# Altium schematic sheet teensyRecord.SchDoc
size Legal
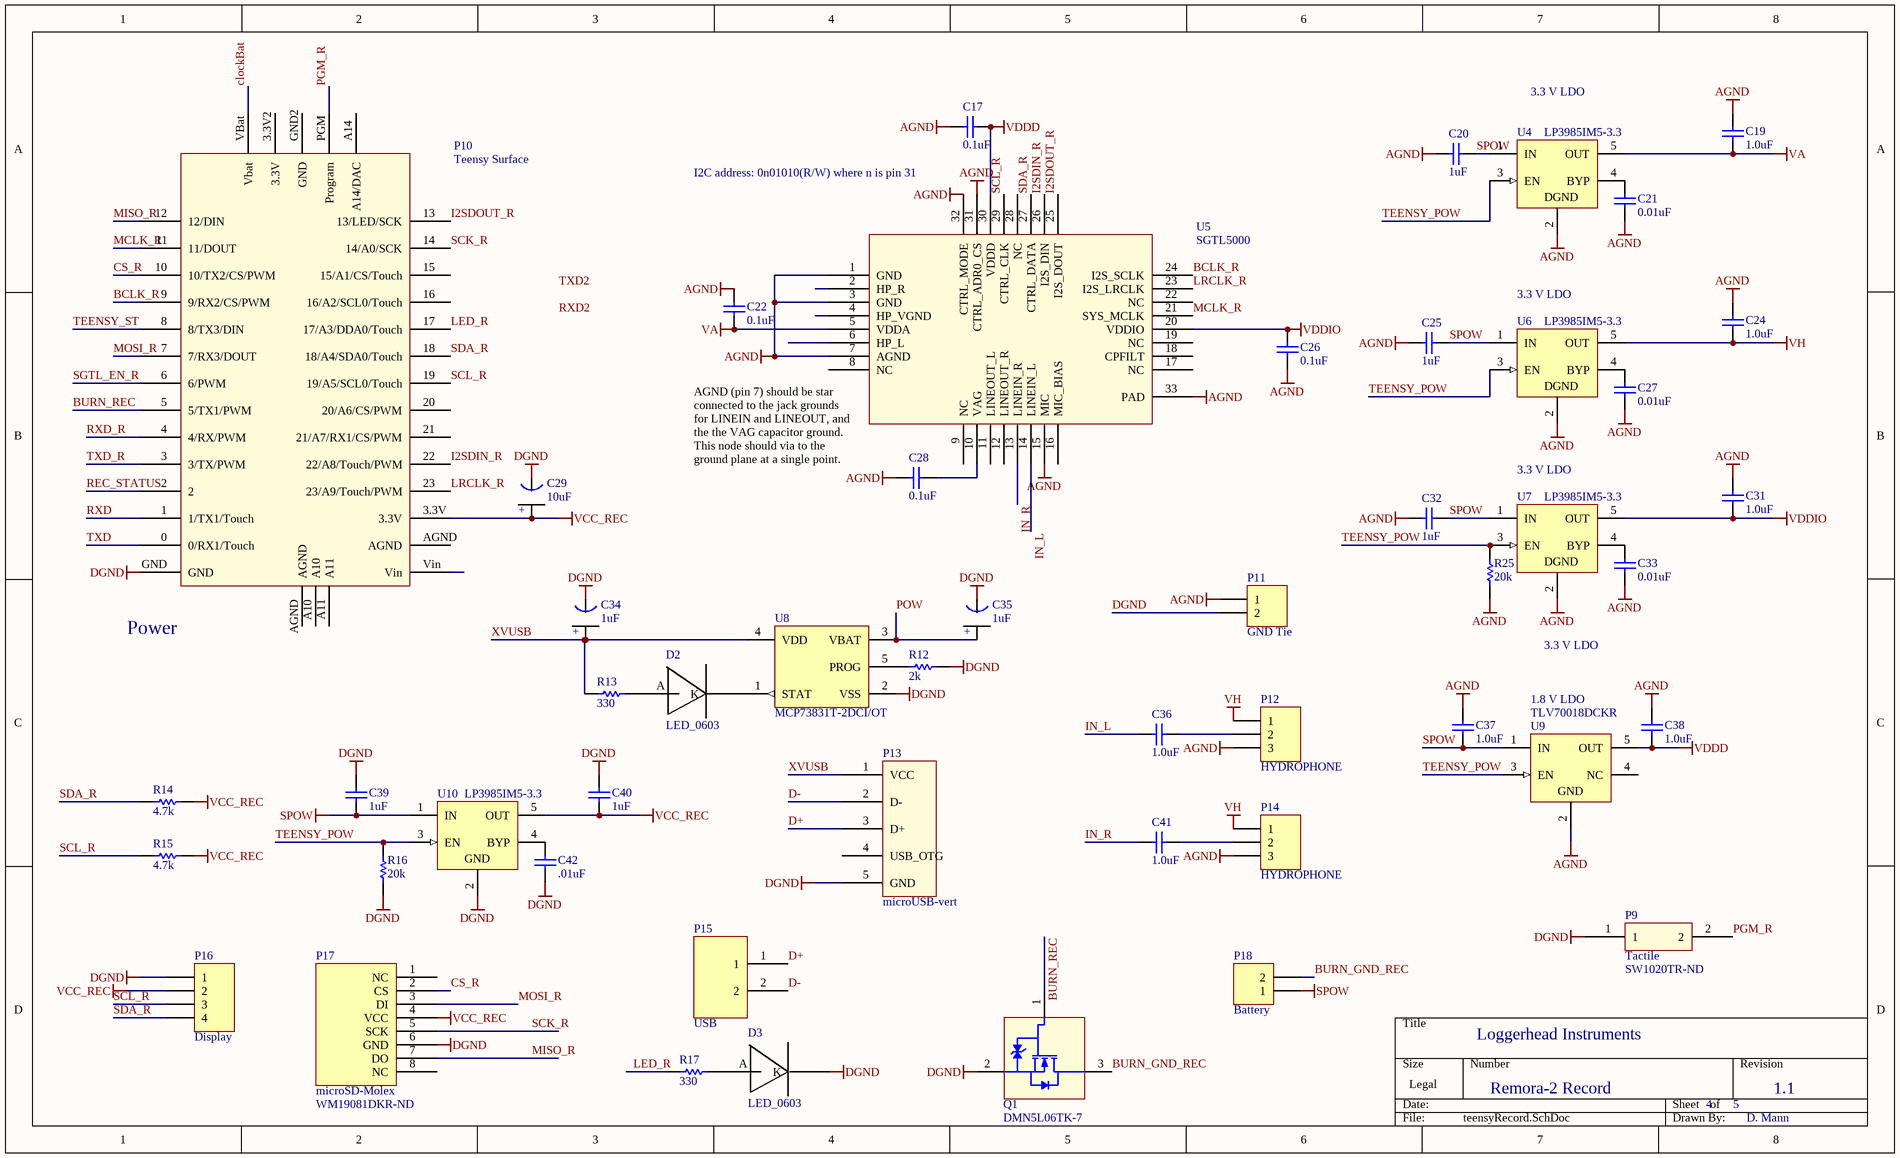
[diagram p0: teensyRecord.SchDoc]

## Parts
C17  0.1uF  [0402]
C19  1.0uF  [0402]
C20  1uF  [0402]
C21  0.01uF  [0402]
C22  0.1uF  [0402]
C24  1.0uF  [0402]
C25  1uF  [0402]
C26  0.1uF  [0402]
C27  0.01uF  [0402]
C28  0.1uF  [0402]
C29  10uF  [Tant0805]
C31  1.0uF  [0402]
C32  1uF  [0402]
C33  0.01uF  [0402]
C34  1uF  [Tant0805]
C35  1uF  [Tant0805]
C36  1.0uF  [0402]
C37  1.0uF  [0402]
C38  1.0uF  [0402]
C39  1uF  [0402]
C40  1uF  [0402]
C41  1.0uF  [0402]
C42  .01uF  [0402]
D2  LED_0603  [Diode0603]
D3  LED_0603  [Diode0603]
P9  Tactile  Supplier Part Number 1: SW1020TR-ND  [Tactile-B3U-1000]
P10  Teensy Surface  [TEENSY3.2_surface_mount]
P11  GND Tie  [HDR1X2]
P12  HYDROPHONE  [HDR1X3]
P13  microUSB-vert  [MICROUSB-VERT]
P14  HYDROPHONE  [HDR1X3]
P15  USB  [HDR_2x1_2mm]
P16  Display  [HDR1X4]
P17  microSD-Molex  Supplier Part Number 1: WM19081DKR-ND  [microSD_Molex_hinged]
P18  Battery  [HDR1X2]
Q1  DMN5L06TK-7  [SOT-523]
R12  2k  [3-0603]
R13  330  [3-0603]
R14  4.7k  [3-0603]
R15  4.7k  [3-0603]
R16  20k  [3-0603]
R17  330  [3-0603]
R25  20k  [3-0603]
U4  LP3985IM5-3.3  [MF05A_N]
U5  SGTL5000  [QFN32]
U6  LP3985IM5-3.3  [MF05A_N]
U7  LP3985IM5-3.3  [MF05A_N]
U8  MCP73831T-2DCI/OT  [SOT-23-OT5_N]
U9  TLV70018DCKR  [TI-DCK5_V]
U10  LP3985IM5-3.3  [MF05A_N]

## Nets
AGND: C17.2 C19.2 C20.2 C21.2 C22.2 C24.2 C25.2 C26.2 C27.2 C28.2 C31.2 C32.2 C33.2 C37.2 C38.2 P11.1 P12.3 P14.3 R25.2 U4.2(GND) U5.1(GND) U5.3(GND) U5.7(AGND) U5.15(MIC) U5.31(CTRL_ADR0_CS) U5.32(CTRL_MODE) U5.33(PAD) U6.2(GND) U7.2(GND) U9.2(GND)
DGND: C29.1(GND) C34.1(GND) C35.1(GND) C39.2 C40.2 C42.1 D3.K P9.1 P10.GND P11.2 P13.5(GND) P16.1 P17.6(GND) Q1.2(S) R12.1 R16.1 U8.2(VSS) U10.2(GND)
SPOW: C20.1 C25.1 C32.1 C37.1 C39.1 P18.1 U4.1(IN) U6.1(IN) U7.1(IN) U9.1(IN) U10.1(IN)
VA: C19.1 C22.1 U4.5(OUT) U5.5(VDDA)
VCC_REC: C29.2(+) C40.1 P10.3.3V P16.2 P17.4(VCC) R14.2 R15.2 U10.5(OUT)
VDDD: C17.1 C38.1 U5.30(VDDD) U9.5(OUT)
VDDIO: C26.1 C31.1 U5.20(VDDIO) U7.5(OUT)
VH: C24.1 P12.1 P14.1 U6.5(OUT)
BCLK_R: P10.9(9/RX2/CS/PWM) U5.24(I2S_SCLK)
BURN_GND_REC: P18.2 Q1.3(D)
BURN_REC: P10.5(5/TX1/PWM) Q1.1(G)
clockBat: P10.VBat(Vbat)
CS_R: P10.10(10/TX2/CS/PWM) P17.2(CS)
D+: P13.3(D+) P15.1
D-: P13.2(D-) P15.2
I2SDIN_R: P10.22(22/A8/Touch/PWM) U5.26(I2S_DIN)
I2SDOUT_R: P10.13(13/LED/SCK) U5.25(I2S_DOUT)
IN_L: C36.2 U5.14(LINEIN_L)
IN_R: C41.2 U5.13(LINEIN_R)
LED_R: P10.17(17/A3/DDA0/Touch) R17.1
LRCLK_R: P10.23(23/A9/Touch/PWM) U5.23(I2S_LRCLK)
MCLK_R: P10.11(11/DOUT) U5.21(SYS_MCLK)
MISO_R: P10.12(12/DIN) P17.7(DO)
MOSI_R: P10.7(7/RX3/DOUT) P17.3(DI)
PGM_R: P9.2 P10.PGM(Program)
POW: C35.2(+) U8.3(VBAT)
REC_STATUS: P10.2
RXD: P10.1(1/TX1/Touch)
RXD_R: P10.4(4/RX/PWM)
SCK_R: P10.14(14/A0/SCK) P17.5(SCK)
SCL_R: P10.19(19/A5/SCL0/Touch) P16.3 R15.1 U5.29(CTRL_CLK)
SDA_R: P10.18(18/A4/SDA0/Touch) P16.4 R14.1 U5.27(CTRL_DATA)
SGTL_EN_R: P10.6(6/PWM)
TEENSY_POW: R16.2 R25.1 U4.3(EN) U6.3(EN) U7.3(EN) U9.3(EN) U10.3(EN)
TEENSY_ST: P10.8(8/TX3/DIN)
TXD: P10.0(0/RX1/Touch)
TXD_R: P10.3(3/TX/PWM)
XVUSB: C34.2(+) P13.1(VCC) R13.1 U8.4(VDD)
NetC21_1: C21.1 U4.4(BYP)
NetC27_1: C27.1 U6.4(BYP)
NetC28_1: C28.1 U5.10(VAG)
NetC33_1: C33.1 U7.4(BYP)
NetC36_1: C36.1 P12.2
NetC41_1: C41.1 P14.2
NetC42_2: C42.2 U10.4(BYP)
NetD2_A: D2.A R13.2
NetD2_K: D2.K U8.1(STAT)
NetD3_A: D3.A R17.2
NetR12_2: R12.2 U8.5(PROG)

Not connected (* = marked no-connect by the designer): P10 3.3V2(3.3V) 15(15/A1/CS/Touch) 16(16/A2/SCL0/Touch) 20(20/A6/CS/PWM) 21(21/A7/RX1/CS/PWM) A10 A11 A14(A14/DAC) AGND GND2(GND) Vin; P13 4(USB_OTG); P17 1(NC) 8(NC); U5 2(HP_R) 4(HP_VGND) 6(HP_L) 8(NC) 9(NC) 11(LINEOUT_L) 12(LINEOUT_R) 16(MIC_BIAS) 17(NC) 18(CPFILT) 19(NC) 22(NC) 28(NC); U9 4(NC)

## Notes on the sheet
- 3.3 V LDO
- I2C address: 0n01010(R/W) where n is pin 31
- (near U6) 3.3 V LDO
- (near U5) AGND (pin 7) should be star connected to the jack grounds for LINEIN and LINEOUT, and the the VAG capacitor ground. This node should via to the ground plane at a single point.
- (near U7) 3.3 V LDO
- (near P10) Power
- (near U9) 1.8 V LDO
- Loggerhead Instruments
- Remora-2 Record
- 4
- 5
- 1.1
- D. Mann
- Labels drawn without touching a wire or pin: RXD2, TXD2
- (in symbol LP3985IM5-3.3) DGND

## Library data of the parts
C17 C22 C26 C28 = C0402: Ceramic Chip Capacitor - Standard; Note: Footprint corresponds to dimensions for bulk cassette packaging. This case size has tightened tolerances.; Published: 17-Jul-2002; LatestRevisionDate: 19-Mar-2004; LatestRevisionNote: Silkscreen size reduced.; DatasheetDocument: Mar-2001; PackageDocument: Mar-2001; PackageReference: 0402; Publisher: Altium Limited; Code_JEITA: 0402; Code_IPC: 1005 [0402]; ComponentLink1Description: Manufacturer Link; ComponentLink1URL: http://www.kemet.com/; ComponentLink2Description: Datasheet; ComponentLink2URL: http://www.kemet.com/kemet/web/homepage/kechome.nsf/vapubfilesname/F3102TA.pdf/$file/F3102TA.pdf; Value: 0.1uF
C19-C21 C24 C25 C27 C31-C33 C36-C42 = C0402: Ceramic Chip Capacitor - Standard; Note: Footprint corresponds to dimensions for bulk cassette packaging. This case size has tightened tolerances.; Value: 0.1uF; Published: 17-Jul-2002; LatestRevisionDate: 19-Mar-2004; LatestRevisionNote: Silkscreen size reduced.; DatasheetDocument: Mar-2001; PackageDocument: Mar-2001; PackageReference: 0402; Publisher: Altium Limited; Code_JEITA: 0402; Code_IPC: 1005 [0402]; ComponentLink1Description: Manufacturer Link; ComponentLink1URL: http://www.kemet.com/; ComponentLink2Description: Datasheet; ComponentLink2URL: http://www.kemet.com/kemet/web/homepage/kechome.nsf/vapubfilesname/F3102TA.pdf/$file/F3102TA.pdf
C29 C34 C35 = Tant0805
  C29: Value: 10uF
  C34 C35: Value: 1uF
P9 = Tactile_B3U-1000: Supplier 1: Digi-Key
P10 = Teensy3.2_surface_mount
P11 P18 = Header 2: Header, 2-Pin; LatestRevisionDate: 17-Jul-2002; LatestRevisionNote: Re-released for DXP Platform.; Publisher: Altium Limited
P12 P14 = Header 3: Header, 3-Pin; LatestRevisionDate: 17-Jul-2002; LatestRevisionNote: Re-released for DXP Platform.; Publisher: Altium Limited
P13 = microUSB-vert: Molex 105133-0011
P15 = HDR_2x1_2mm: Charging Connector
P16 = Header 4: Header, 4-Pin; LatestRevisionDate: 17-Jul-2002; LatestRevisionNote: Re-released for DXP Platform.; Publisher: Altium Limited
P17 = microSD_Molex_hinged: Supplier 1: Digi-Key
Q1 = FET DMN5L06TK-7: Ultra-low leakage Enhanced MOSFET; Fabrication Tested: NO; Creator and Date: Will Flanery 2010-09-02; Footprint Verified By: *; Schematic Verified By: *; Vendor Info Verified By: *; Supplier 1: Digi-Key; Supplier Part Number 1: DMN5L06TKDICT-ND; HelpURL: http://www.diodes.com/datasheets/ds30926.pdf
R12-R17 R25 = ERJ3RK: Precision Thick Film Chip Resistor, 10 Ohm to 1M Ohm Range, 1% and 0.5% Tolerance, 0603 Size, 0.063 W; Published: 17-Dec-2003; LatestRevisionDate: 19-Mar-2004; LatestRevisionNote: Silkscreen size reduced.; PackageDocument: Mar-2003; PackageReference: 3-0603; Publisher: Altium Limited; Code_IPC: 1608 [0603]; ComponentLink1Description: Manufacturer Link; ComponentLink1URL: http://www.panasonic.com/industrial/components/resistive_products.htm; ComponentLink2Description: Datasheet; ComponentLink2URL: http://www.panasonic.com/industrial/components/pdf/AOA0000CE2.pdf
U4 U6 U7 U10 = LP3985IM5-3.3: Micropower, 150mA Low-Noise Ultra Low-Dropout CMOS Voltage Regulator; Manufacturer: National Semiconductor; CompType: LDO IC; PackageTopMarking: LDQB*XTT; PowerWise: N; Published: 4-Dec-2008; DatasheetVersion: Aug-2005; PackageVersion: revD, Aug-2008; PackageReference: MF05A; Publisher: Altium Limited; PackageDescription: Molded SOT-23, .115 x .063 x .040 in Body, 5 Lead, .0375 in Pitch; PartNumber: LP3985IM5-3.3; RoHS: O; PinCount: 5; DigiKeyPartNumber: LP3985IM5-3.3CT-ND; ComponentLink1Description: LP3985 Datasheet; ComponentLink1URL: http://www.national.com/ds/LP/LP3985.pdf; ComponentLink2Description: LP3985 Web Page; ComponentLink2URL: http://www.national.com/pf/LP/LP3985.html; ComponentLink3Description: MF05A Package Page; ComponentLink3URL: http://www.national.com/packaging/folders/mf05a.html
U8 = MCP73831T-2DCI/OT: Miniature Single-Cell, Fully Integrated Li-Ion, Li-Polymer Charge Management Controller, 4.2V, 5-Pin SOT-23, Industrial Temperature, Tape and Reel; DatasheetVersion: revE, Sep-2008; PackageVersion: revBB, Aug-2009; PackageReference: SOT-23-OT5; PackageDescription: 5-Lead Plastic Small Outline Transistor (OT) [SOT-23]; Code_IPC: SOT23-5; ComponentLink1Description: Manufacturer URL; ComponentLink1URL: http://www.microchip.com/; ComponentLink2Description: Datasheet; ComponentLink2URL: http://ww1.microchip.com/downloads/en/DeviceDoc/21984e.pdf; ComponentLink3Description: Package Specification; ComponentLink3URL: http://www.microchip.com/stellent/groups/techpub_sg/documents/packagingspec/en012702.pdf
U9 = TLV70018DCKR: Single Output LDO, 200 mA, Fixed 1.8 V Output, 2 to 5.5 V Input, with Low IQ, 5-pin SC70 (DCK), -40 to 125 degC, Green (RoHS & no Sb/Br); Manufacturer: Texas Instruments; Accuracy(%): 2; Fixed Output Options(V): 1.8; Iout(Max)(A): 0.2; Iq(Typ)(mA): 0.03; SubFamily: Single Channel LDO; Vdo(Typ)(mV): 175; Vin(Max)(V): 5.5; DatasheetVersion: SLVSA00D; PackageVersion: 4093553-3/G; PackageReference: DCK5; PackageDescription: 5-Pin Plastic Small-Outline, Body 2 x 1.25 mm, Pitch 0.65 mm; Supplier 1: Digi-Key; Supplier Part Number 1: 296-32409-2-ND; Supplier 2: Digi-Key; Supplier Part Number 2: 296-32409-1-ND; Supplier 3: Digi-Key; Supplier Part Number 3: 296-32409-6-ND; Supplier 4: Newark; Supplier Part Number 4: 55R7461; Supplier 5: Mouser; Supplier Part Number 5: 595-TLV70018DCKR; Eco-Plan: Green (RoHS & no Sb/Br); Vin(Min)(V): 2; Vout Adj(Max)(V): 1.8; Vout Adj(Min)(V): 1.8; Mounting Technology: Surface Mount; Code_JEDEC: MO-203; PartNumber: TLV70018DCKR; ComponentLink1Description: Manufacturer URL; ComponentLink1URL: http://www.ti.com/; ComponentLink2Description: Datasheet; ComponentLink2URL: http://www.ti.com/general/docs/lit/getliterature.tsp?genericPartNumber=TLV70018&fileType=pdf; ComponentLink3Description: Package Specification; ComponentLink3URL: http://www.ti.com/litv/pdf/mpds025f